# EAGLE schematic Main board schematics (EAGLE 9.6.2)

## Sheet 1 of 3
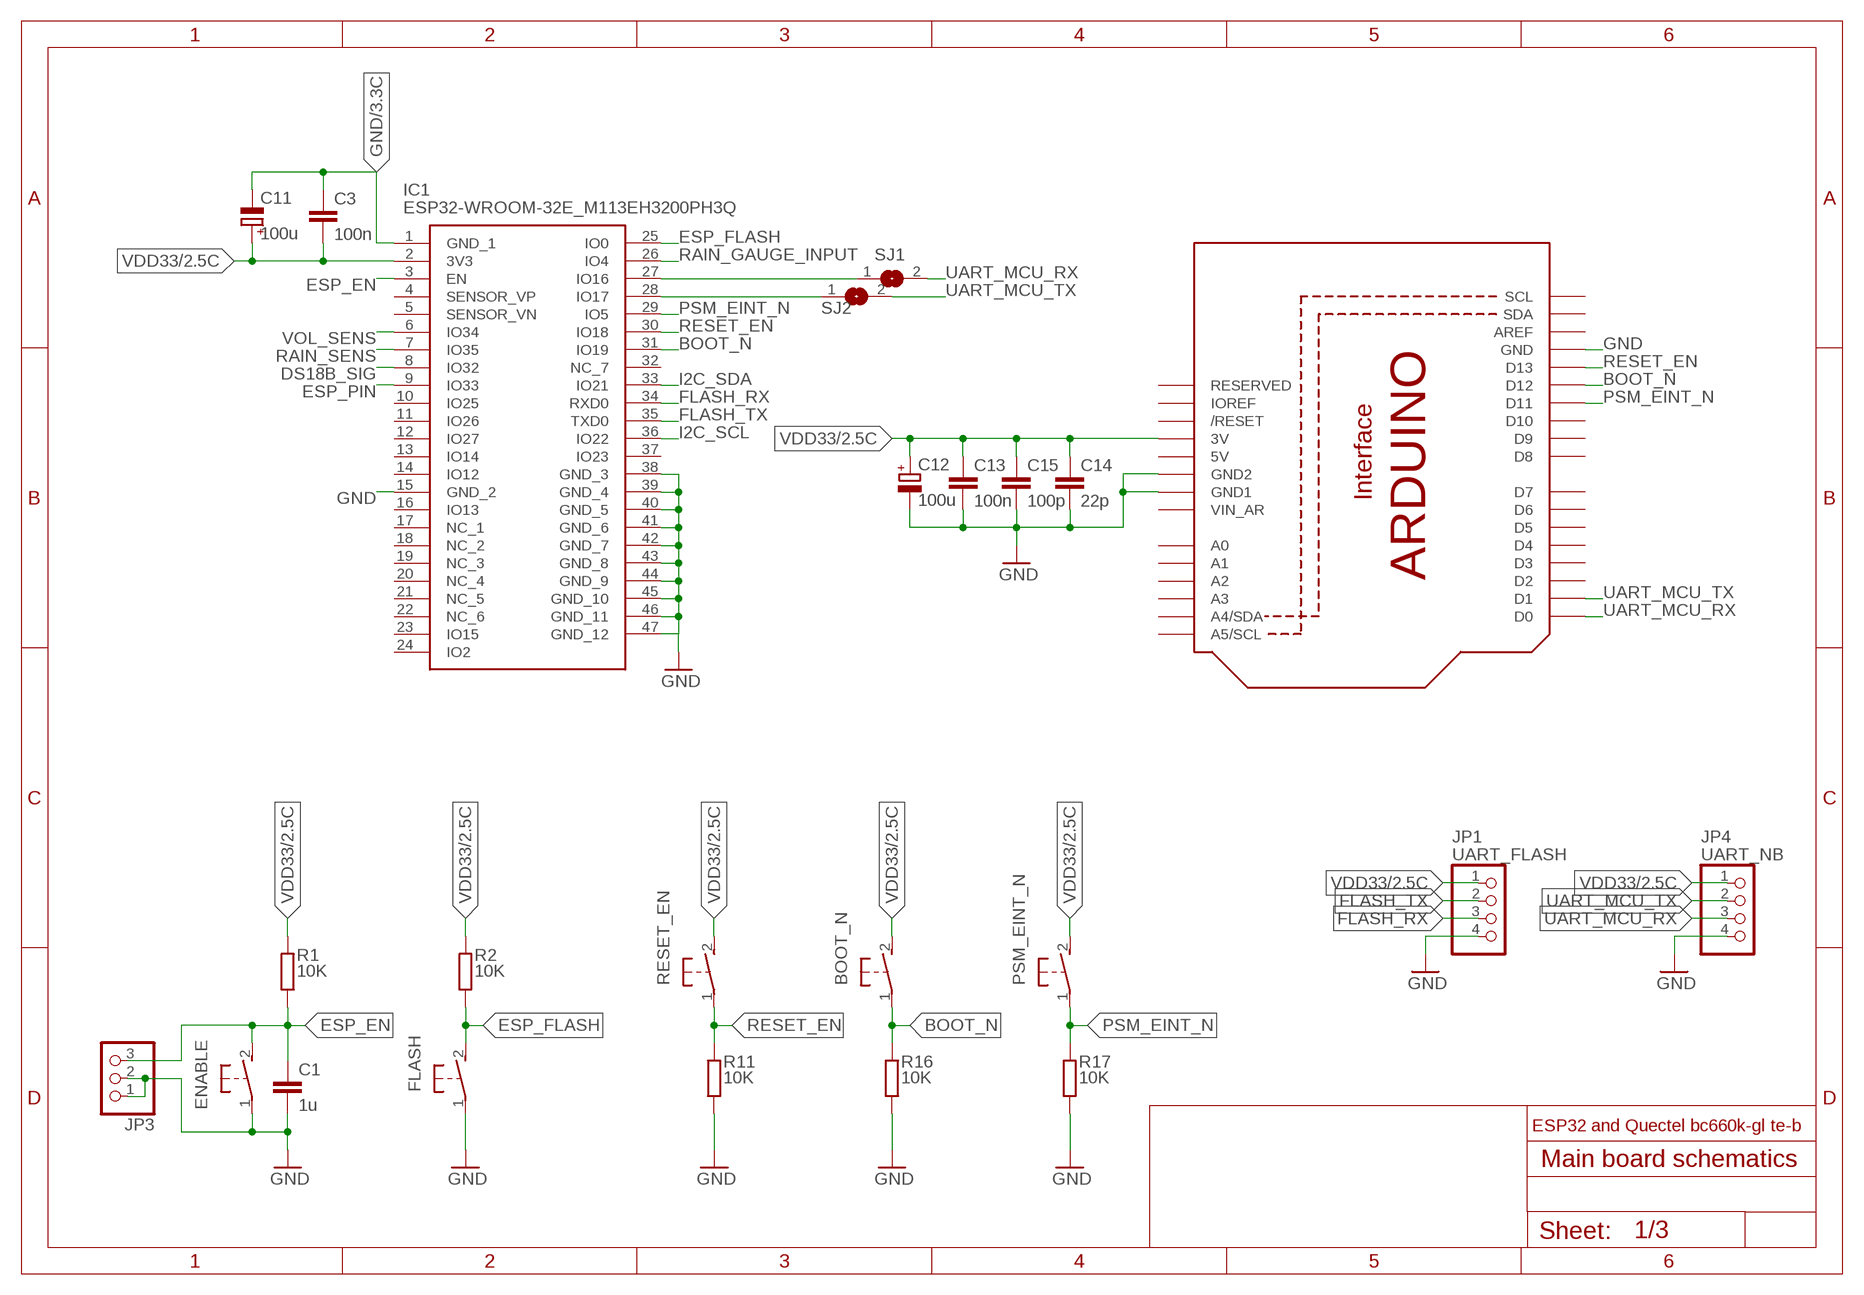
[diagram p0: schematic, sheet 1]

### Parts
BOOT_N  31-XX  [B3F-31XX]
C1  1u  C-EUC0805  [C0805]
C3  100n  C-EUC0805  [C0805]
C11  100u  CPOL-EUD  [PANASONIC_D]
C12  100u  CPOL-EUD  [PANASONIC_D]
C13  100n  C-EUC0805  [C0805]
C14  22p  C-EUC0805  [C0805]
C15  100p  C-EUC0805  [C0805]
ENABLE  31-XX  [B3F-31XX]
FLASH  31-XX  [B3F-31XX]
IC1  ESP32-WROOM-32E_M113EH3200PH3Q  [ESP32WROOM32EM113EH3200PH3Q0]
JP1  UART_FLASH  PINHD-1X4  [1X04]
JP3  PINHD-1X3  [1X03]
JP4  UART_NB  PINHD-1X4  [1X04]
PSM_EINT_N  31-XX  [B3F-31XX]
R1  10K  R-EU_R0805  [R0805]
R2  10K  R-EU_R0805  [R0805]
R11  10K  R-EU_R0805  [R0805]
R16  10K  R-EU_R0805  [R0805]
R17  10K  R-EU_R0805  [R0805]
RESET_EN  31-XX  [B3F-31XX]
SJ1  SJ  [SJ]
SJ2  SJ  [SJ]
U2  ARDUINOR3-BPLACE  [ARDUINOR3]

### Nets
BOOT_N: BOOT_N.1(P) IC1.31(IO19) R16.2 U2.D12
DS18B_SIG: IC1.8(IO32) ; also sheet 3
ESP_EN: C1.1 ENABLE.2(S) IC1.3(EN) JP3.3 R1.1
ESP_FLASH: FLASH.2(S) IC1.25(IO0) R2.1
ESP_PIN: IC1.9(IO33) ; also sheet 3
FLASH_RX: IC1.34(RXD0) JP1.3
FLASH_TX: IC1.35(TXD0) JP1.2
GND: C1.2 C3.1 C11.- C12.- C13.2 C14.2 C15.2 ENABLE.1(P) FLASH.1(P) IC1.1(GND_1) IC1.15(GND_2) IC1.38(GND_3) IC1.39(GND_4) IC1.40(GND_5) IC1.41(GND_6) IC1.42(GND_7) IC1.43(GND_8) IC1.44(GND_9) IC1.45(GND_10) IC1.46(GND_11) IC1.47(GND_12) JP1.4 JP3.1 JP3.2 JP4.4 R11.1 R16.1 R17.1 U2.D14(GND) U2.GND U2.GND1 U2.GND2 ; also sheet 2,3
I2C_SCL: IC1.36(IO22) ; also sheet 3
I2C_SDA: IC1.33(IO21) ; also sheet 3
N$1: IC1.27(IO16) SJ1.1
N$2: IC1.28(IO17) SJ2.1
PSM_EINT_N: IC1.29(IO5) PSM_EINT_N.1(P) R17.2 U2.D11
RAIN_GAUGE_INPUT: IC1.26(IO4) ; also sheet 3
RAIN_SENS: IC1.7(IO35)
RESET_EN: IC1.30(IO18) R11.2 RESET_EN.1(P) U2.D13
UART_MCU_RX: JP4.3 SJ1.2 U2.D0
UART_MCU_TX: JP4.2 SJ2.2 U2.D1
VDD33: BOOT_N.2(S) C3.2 C11.+ C12.+ C13.1 C14.1 C15.1 IC1.2(3V3) JP1.1 JP4.1 PSM_EINT_N.2(S) R1.2 R2.2 RESET_EN.2(S) U2.VBAT(3V) ; also sheet 2,3
VOL_SENS: IC1.6(IO34) ; also sheet 3
Unconnected: IC1.4(SENSOR_VP) IC1.5(SENSOR_VN) IC1.10(IO25) IC1.11(IO26) IC1.12(IO27) IC1.13(IO14) IC1.14(IO12) IC1.16(IO13) IC1.17(NC_1) IC1.18(NC_2) IC1.19(NC_3) IC1.20(NC_4) IC1.21(NC_5) IC1.22(NC_6) IC1.23(IO15) IC1.24(IO2) IC1.32(NC_7) IC1.37(IO23) U2.A0 U2.A1 U2.A2 U2.A3 U2.A4(A4/SDA) U2.A5(A5/SCL) U2.AREF U2.D2 U2.D3 U2.D4 U2.D5 U2.D6 U2.D7 U2.D8 U2.D9 U2.D10 U2.IOREF U2.RESERVED U2.RESET(/RESET) U2.SCL U2.SDA

### Notes on the sheet
- ESP32 and Quectel bc660k-gl te-b

## Sheet 2 of 3
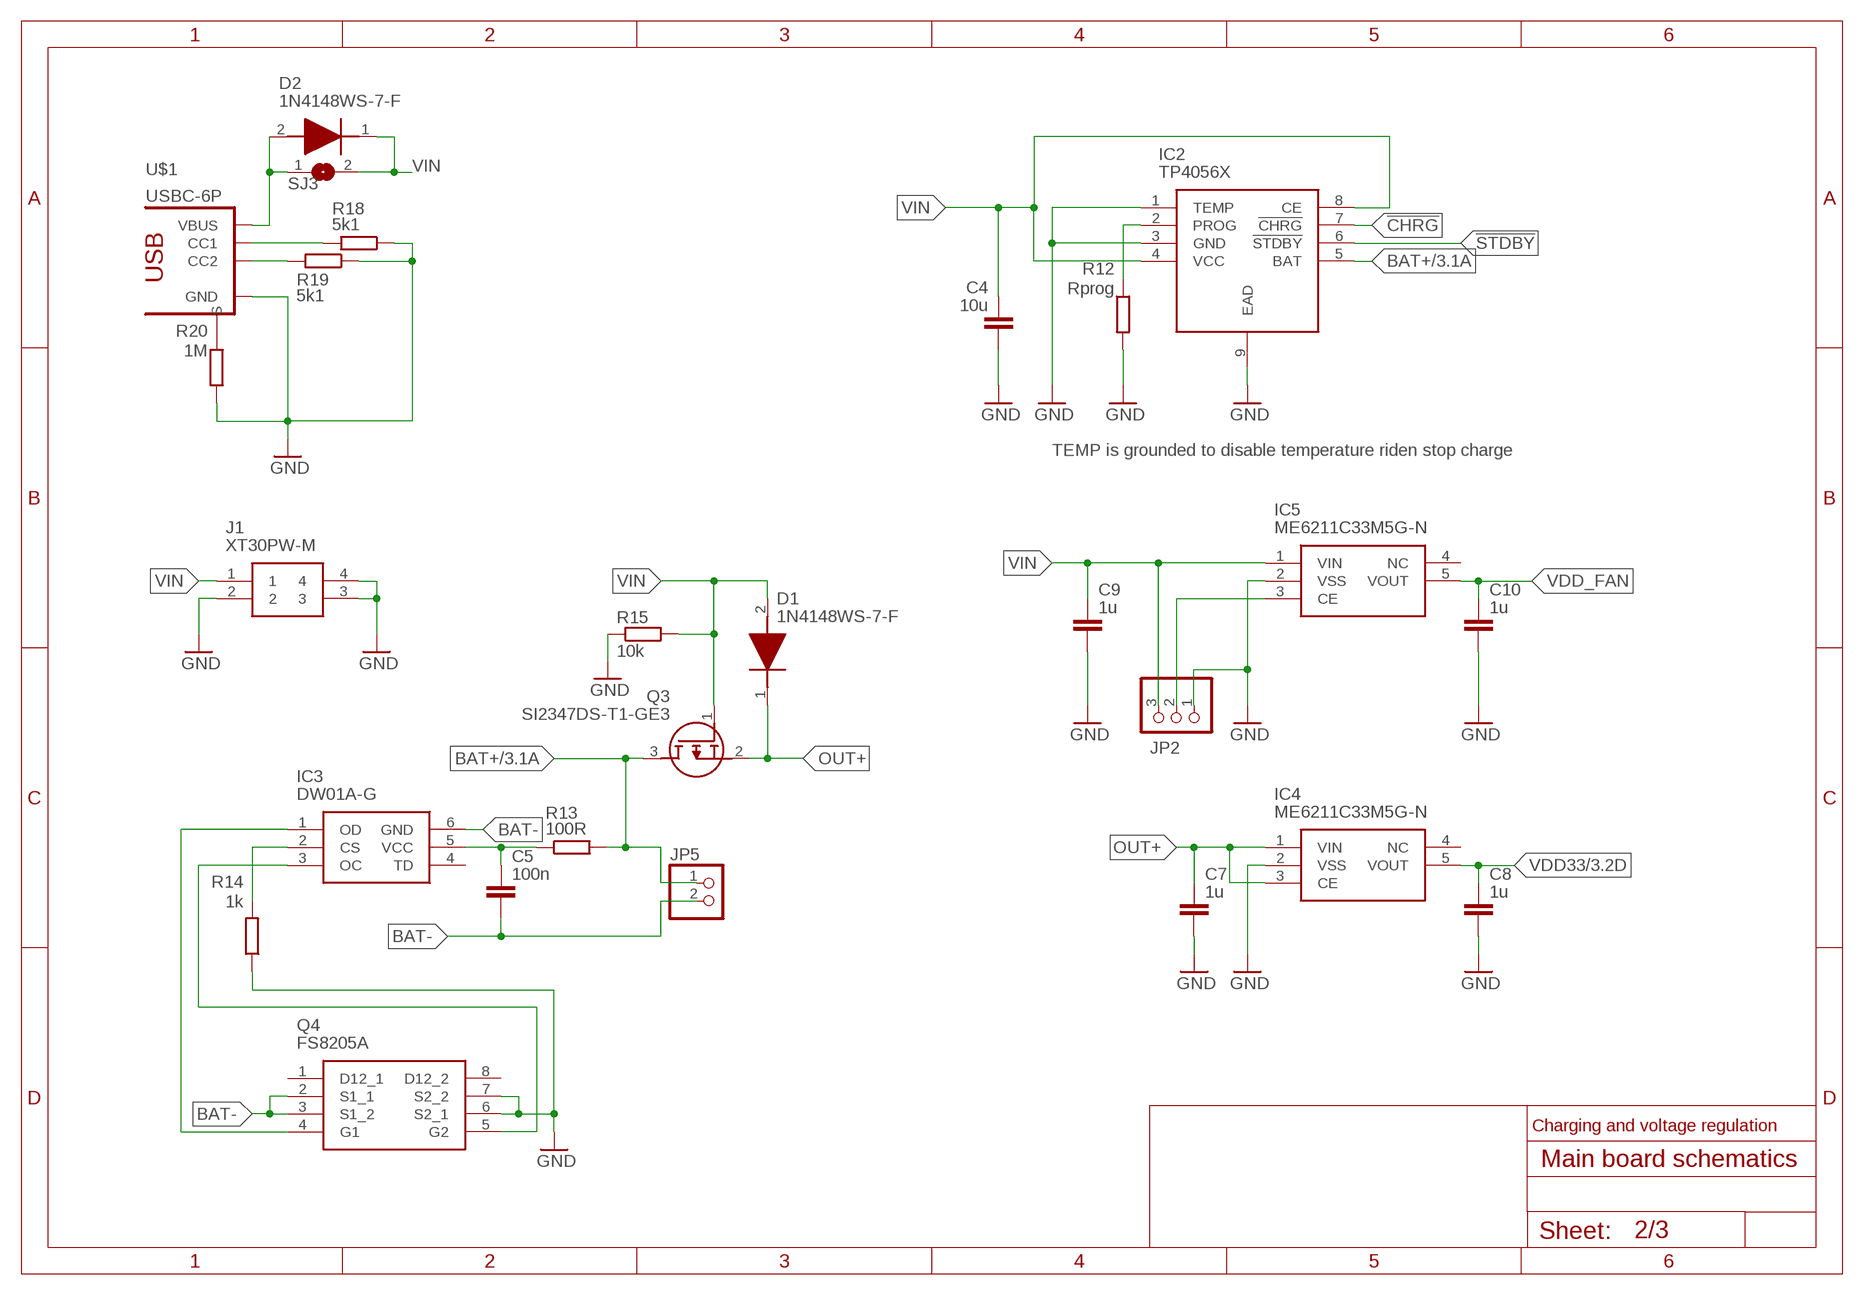
[diagram p1: schematic, sheet 2]

### Parts
C4  10u  C-EUC0805  [C0805]
C5  100n  C-EUC0805  [C0805]
C7  1u  C-EUC0805  [C0805]
C8  1u  C-EUC0805  [C0805]
C9  1u  C-EUC0805  [C0805]
C10  1u  C-EUC0805  [C0805]
D1  1N4148WS-7-F  [SOD2513X120N]
D2  1N4148WS-7-F  [SOD2513X120N]
IC2  TP4056X  [SOIC127P600X175-9N]
IC3  DW01A-G  [SOT95P280X135-6N]
IC4  ME6211C33M5G-N  [SOT95P270X145-5N]
IC5  ME6211C33M5G-N  [SOT95P270X145-5N]
J1  XT30PW-M  [XT30PWM]
JP2  PINHD-1X3  [1X03]
JP5  PINHD-1X2  [1X02]
Q3  SI2347DS-T1-GE3  [SOT95P237X112-3N]
Q4  FS8205A  [SOP65P640X120-8N]
R12  Rprog  R-EU_R0805  [R0805]
R13  100R  R-EU_R0805  [R0805]
R14  1k  R-EU_R0805  [R0805]
R15  10k  R-EU_R0805  [R0805]
R18  5k1  R-EU_R0805  [R0805]
R19  5k1  R-EU_R0805  [R0805]
R20  1M  R-EU_R0805  [R0805]
SJ3  SJ  [SJ]
U$1  USBC-6P  [USCX-06FX-XXMX-01]

### Nets
!CHRG: IC2.7(!CHRG)
!STDBY: IC2.6(!STDBY)
BAT+: IC2.5(BAT) JP5.1 Q3.3(D) R13.2 ; also sheet 3
BAT-: C5.2 IC3.6(GND) JP5.2 Q4.2(S1_1) Q4.3(S1_2)
GND: C4.2 C7.2 C8.2 C9.2 C10.2 IC2.1(TEMP) IC2.3(GND) IC2.9(EAD) IC4.2(VSS) IC5.2(VSS) J1.2 J1.3 J1.4 JP2.1 Q4.6(S2_1) Q4.7(S2_2) R12.2 R14.1 R15.1 R18.1 R19.1 R20.2 U$1.GND1(GND) U$1.GND2(GND) ; also sheet 1,3
N$4: IC2.2(PROG) R12.1
N$5: D2.2(A) SJ3.1 U$1.VBUS1(VBUS) U$1.VBUS2(VBUS)
N$6: IC5.3(CE) JP2.2
N$7: C5.1 IC3.5(VCC) R13.1
N$8: R20.1 U$1.SHIELD1(S) U$1.SHIELD2(S) U$1.SHIELD3(S) U$1.SHIELD4(S)
N$9: IC3.2(CS) R14.2
N$10: IC3.1(OD) Q4.4(G1)
N$11: R19.2 U$1.CC2
N$12: IC3.3(OC) Q4.5(G2)
N$13: R18.2 U$1.CC1
OUT+: C7.1 D1.1(K) IC4.1(VIN) IC4.3(CE) Q3.2(S)
VDD33: C8.1 IC4.5(VOUT) ; also sheet 1,3
VDD_FAN: C10.1 IC5.5(VOUT) ; also sheet 3
VIN: C4.1 C9.1 D1.2(A) D2.1(K) IC2.4(VCC) IC2.8(CE) IC5.1(VIN) J1.1 JP2.3 Q3.1(G) R15.2 SJ3.2
Unconnected: IC3.4(TD) IC4.4(NC) IC5.4(NC) Q4.1(D12_1) Q4.8(D12_2)

### Notes on the sheet
- TEMP is grounded to disable temperature riden stop charge
- Charging and voltage regulation

## Sheet 3 of 3
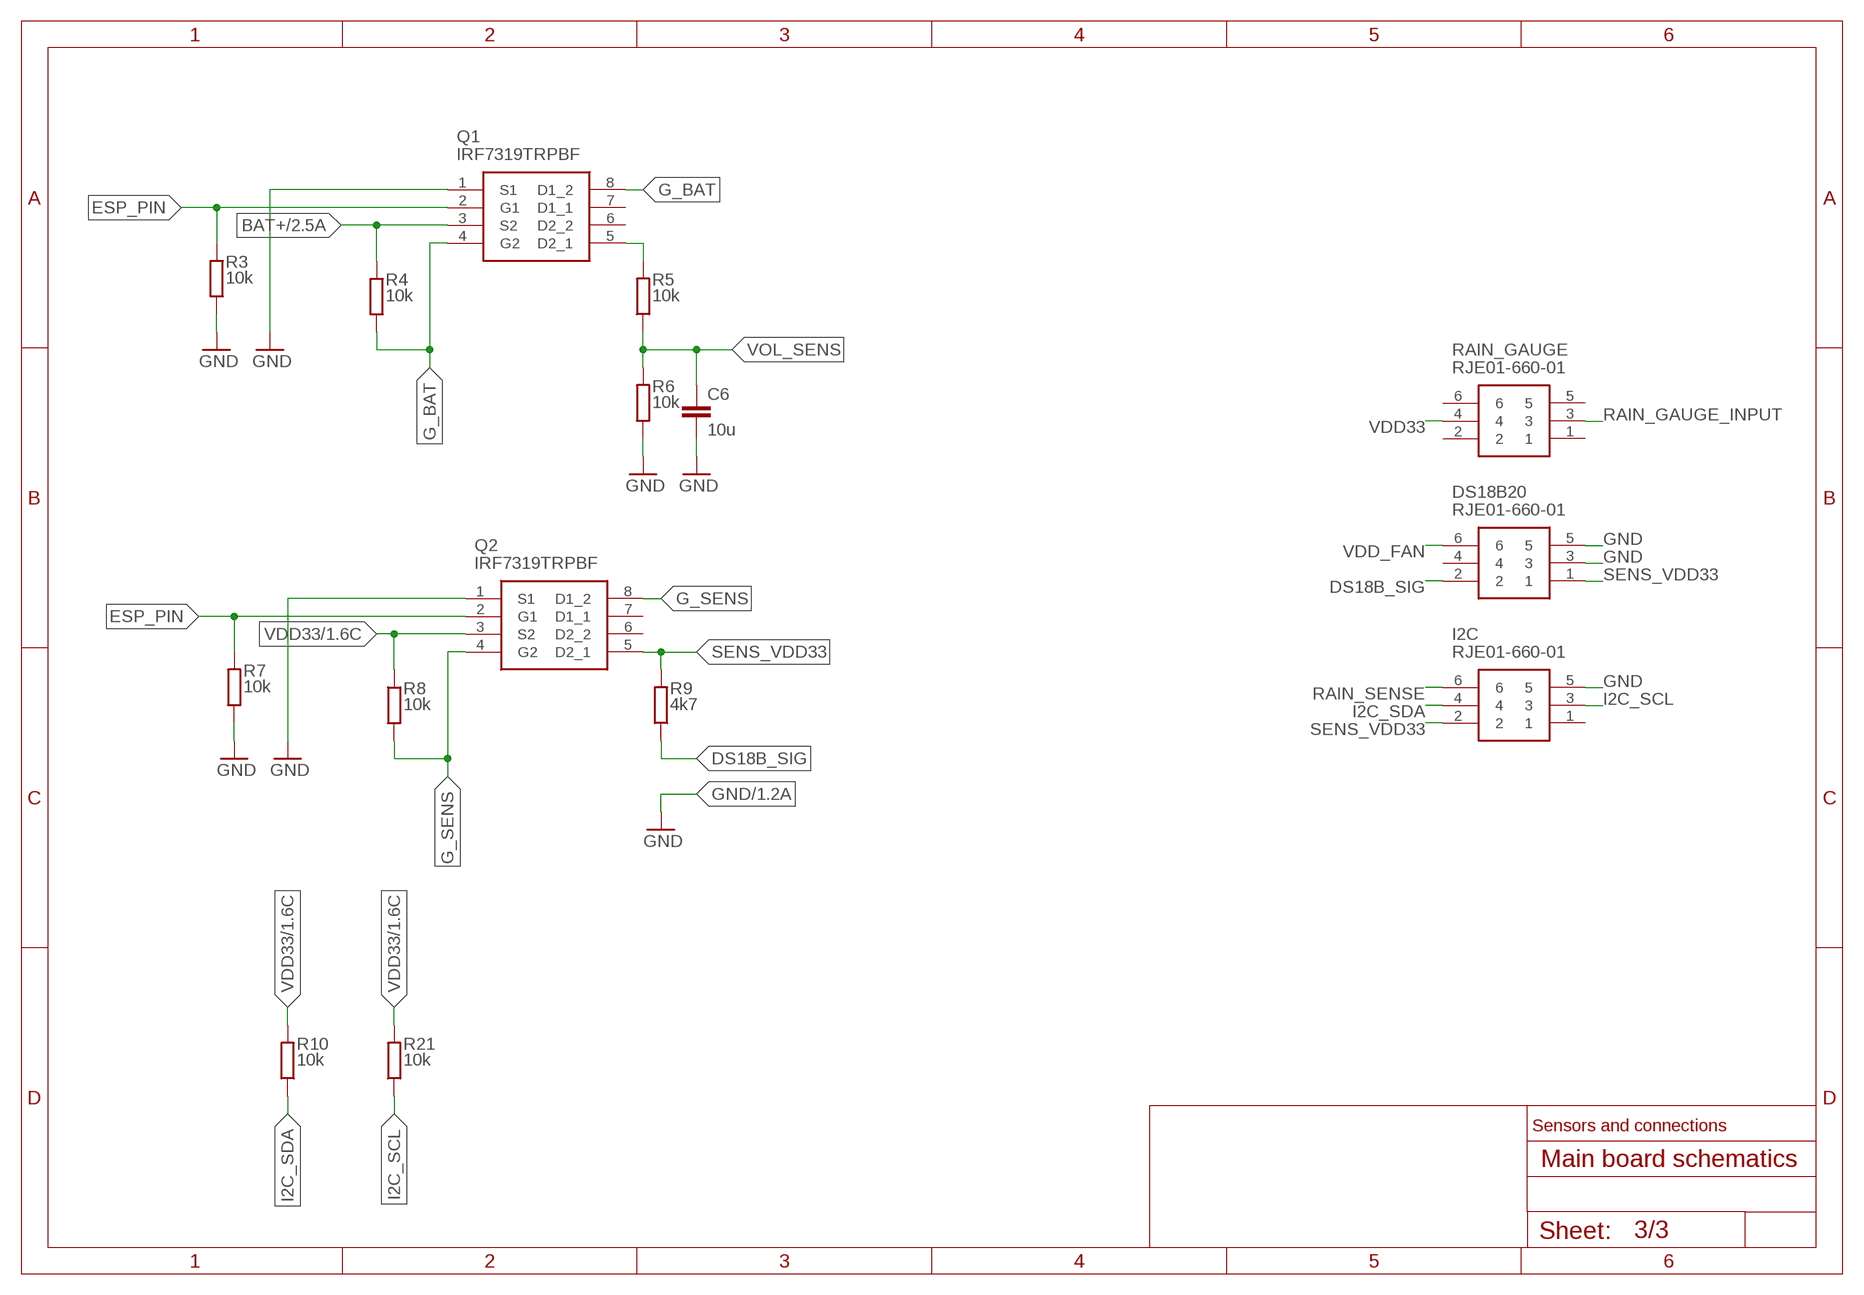
[diagram p2: schematic, sheet 3]

### Parts
C6  10u  C-EUC1206  [C1206]
DS18B20  RJE01-660-01  [RJE0166001]
I2C  RJE01-660-01  [RJE0166001]
Q1  IRF7319TRPBF  [SOIC127P600X175-8N]
Q2  IRF7319TRPBF  [SOIC127P600X175-8N]
R3  10k  R-EU_R0805  [R0805]
R4  10k  R-EU_R0805  [R0805]
R5  10k  R-EU_R0805  [R0805]
R6  10k  R-EU_R0805  [R0805]
R7  10k  R-EU_R0805  [R0805]
R8  10k  R-EU_R0805  [R0805]
R9  4k7  R-EU_R0805  [R0805]
R10  10k  R-EU_R0805  [R0805]
R21  10k  R-EU_R0805  [R0805]
RAIN_GAUGE  RJE01-660-01  [RJE0166001]

### Nets
BAT+: Q1.3(S2) R4.1 ; also sheet 2
DS18B_SIG: DS18B20.2 R9.1 ; also sheet 1
ESP_PIN: Q1.2(G1) Q2.2(G1) R3.2 R7.2 ; also sheet 1
G_BAT: Q1.4(G2) Q1.8(D1_2) R4.2
G_SENS: Q2.4(G2) Q2.8(D1_2) R8.2
GND: C6.2 DS18B20.3 DS18B20.5 I2C.5 Q1.1(S1) Q2.1(S1) R3.1 R6.1 R7.1 ; also sheet 1,2
I2C_SCL: I2C.3 R21.1 ; also sheet 1
I2C_SDA: I2C.4 R10.1 ; also sheet 1
N$3: Q1.5(D2_1) R5.2
RAIN_GAUGE_INPUT: RAIN_GAUGE.3 ; also sheet 1
RAIN_SENSE: I2C.6
SENS_VDD33: DS18B20.1 I2C.2 Q2.5(D2_1) R9.2
VDD33: Q2.3(S2) R8.1 R10.2 R21.2 RAIN_GAUGE.4 ; also sheet 1,2
VDD_FAN: DS18B20.6 ; also sheet 2
VOL_SENS: C6.1 R5.1 R6.2 ; also sheet 1
Unconnected: DS18B20.4 I2C.1 Q1.6(D2_2) Q1.7(D1_1) Q2.6(D2_2) Q2.7(D1_1) RAIN_GAUGE.1 RAIN_GAUGE.2 RAIN_GAUGE.5 RAIN_GAUGE.6

### Notes on the sheet
- Sensors and connections

## Power pins joined to a net without a drawn wire
5V: U2.5V
VIN_AR: U2.VIN_AR

## Library data of the parts
BOOT_N ENABLE FLASH PSM_EINT_N RESET_EN = switch-omron:31-XX: OMRON SWITCH; MPN: B3F-3100; OC_FARNELL: 959704; OC_NEWARK: 36M3582
C1 C3-C10 C13-C15 = rcl:C-EU: CAPACITOR, European symbol; SPICEPREFIX: C
C11 C12 = rcl:CPOL-EU: POLARIZED CAPACITOR, European symbol; SPICEPREFIX: C
D1 D2 = 1-component-search:1N4148WS-7-F: Diode Switching 150mA 75V 200mW SOD323 Diodes Inc 1N4148WS-7-F Switching Diode, 150mA 75V, 2-Pin SOD-323 Source: Datasheet <https://componentsearchengine.com/Datasheets/2/1N4148WS-7-F.pdf>; ARROW_PART_NUMBER: 1N4148WS-7-F; ARROW_PRICE-STOCK: https://www.arrow.com/en/products/1n4148ws-7-f/diodes-incorporated?region=nac; DESCRIPTION: Diode Switching 150mA 75V 200mW SOD323 Diodes Inc 1N4148WS-7-F Switching Diode, 150mA 75V, 2-Pin SOD-323; HEIGHT: 1.2mm; MANUFACTURER_NAME: Diodes Inc.; MANUFACTURER_PART_NUMBER: 1N4148WS-7-F; MOUSER_PART_NUMBER: 621-1N4148WS-F; MOUSER_PRICE-STOCK: https://www.mouser.co.uk/ProductDetail/Diodes-Incorporated/1N4148WS-7-F?qs=4drIV0IxA0r8aNy7%2Fu4kVw%3D%3D
DS18B20 I2C RAIN_GAUGE = 1-component-search:RJE01-660-01: Modular Connectors / Ethernet Connectors Mod Jack Cat3 RJ11 Gold Source: Datasheet <https://www.mouser.com/datasheet/2/18/amphenol_RJE016X001-1157271.pdf>; ARROW_PART_NUMBER: RJE01-660-01; ARROW_PRICE-STOCK: https://www.arrow.com/en/products/rje01-660-01/amphenol-fci?region=nac; DESCRIPTION: Modular Connectors / Ethernet Connectors Mod Jack Cat3 RJ11 Gold; HEIGHT: 12.88mm; MANUFACTURER_NAME: Amphenol; MANUFACTURER_PART_NUMBER: RJE01-660-01; MOUSER_PART_NUMBER: 523-RJE01-660-01; MOUSER_PRICE-STOCK: https://www.mouser.co.uk/ProductDetail/Amphenol-Commercial-Products/RJE01-660-01?qs=St27ATL478szj4V93DJo9w%3D%3D
IC1 = 1-component-search:ESP32-WROOM-32E_M113EH3200PH3Q: WiFi Modules (802.11) SMD Module ESP32-D0WD-V3, 4 MB SPI flash, PCB antenna Source: Datasheet <https://www.mouser.com/datasheet/2/891/esp32-wroom-32e_esp32-wroom-32ue_datasheet_en-1855879.pdf>; DESCRIPTION: WiFi Modules (802.11) SMD Module ESP32-D0WD-V3, 4 MB SPI flash, PCB antenna; HEIGHT: 3.25mm; MANUFACTURER_NAME: Espressif Systems; MANUFACTURER_PART_NUMBER: ESP32-WROOM-32E(M113EH3200PH3Q0); MOUSER_PART_NUMBER: 356-ESP32WRM32E132PH; MOUSER_PRICE-STOCK: https://www.mouser.co.uk/ProductDetail/Espressif-Systems/ESP32-WROOM-32EM113EH3200PH3Q0?qs=vHuUswq2%252Bsx8Xcp7bzmaHA%3D%3D
IC2 = TP4056X:TP4056X: PMIC - Battery Management SOP-8_EP_150mil RoHS Source: Datasheet <https://datasheet.lcsc.com/szlcsc/Nanjing-Extension-Microelectronics-TP4056X_C191323.pdf>; DESCRIPTION: PMIC - Battery Management SOP-8_EP_150mil RoHS; HEIGHT: 1.75mm; MANUFACTURER_NAME: Nanjing Extension Microelectronics; MANUFACTURER_PART_NUMBER: TP4056X
IC3 = 1-component-search:DW01A-G: One Cell Lithium-ion/Polymer Battery Protection IC Source: Datasheet <http://acoptex.com/uploads/DW01A.pdf>; DESCRIPTION: One Cell Lithium-ion/Polymer Battery Protection IC; HEIGHT: 1.35mm; MANUFACTURER_NAME: Fortune Semiconductor Corporation; MANUFACTURER_PART_NUMBER: DW01A-G
IC4 IC5 = 1-component-search:ME6211C33M5G-N: Fixed 6V 3.3V 500mA SOT-23-5 Low Dropout Regulators(LDO) RoHS Source: Datasheet <https://datasheet.lcsc.com/szlcsc/1811131510_MICRONE-Nanjing-Micro-One-Elec-ME6211C33M5G-N_C82942.pdf>; DESCRIPTION: Fixed 6V 3.3V 500mA SOT-23-5 Low Dropout Regulators(LDO) RoHS; HEIGHT: 1.45mm; MANUFACTURER_NAME: Microne; MANUFACTURER_PART_NUMBER: ME6211C33M5G-N
J1 = 1-component-search:XT30PW-M: 30A Low Temperature Rise Fire Retardant Plug Source: Datasheet <https://www.tme.eu/sl/Document/ce4077e36b79046da520ca73227e15de/XT30PW SPEC.pdf>; DESCRIPTION: 30A Low Temperature Rise Fire Retardant Plug; HEIGHT: 5mm; MANUFACTURER_NAME: Amass; MANUFACTURER_PART_NUMBER: XT30PW-M
JP1 JP4 = pinhead:PINHD-1X4: PIN HEADER
JP2 JP3 = pinhead:PINHD-1X3: PIN HEADER
JP5 = pinhead:PINHD-1X2: PIN HEADER
Q1 Q2 = 1-component-search:IRF7319TRPBF: IRF7319TRPBF Dual N/P-Channel MOSFET, 4.9 A, 6.5 A, 30 V HEXFET, 8-Pin SOIC Infineon Source: Datasheet <https://www.infineon.com/dgdl/irf7319pbf.pdf?fileId=5546d462533600a4015355f5c82f1b41>; ARROW_PART_NUMBER: IRF7319TRPBF; ARROW_PRICE-STOCK: https://www.arrow.com/en/products/irf7319trpbf/infineon-technologies-ag?region=nac; DESCRIPTION: IRF7319TRPBF Dual N/P-Channel MOSFET, 4.9 A, 6.5 A, 30 V HEXFET, 8-Pin SOIC Infineon; HEIGHT: 1.75mm; MANUFACTURER_NAME: Infineon; MANUFACTURER_PART_NUMBER: IRF7319TRPBF; MOUSER_PART_NUMBER: 942-IRF7319TRPBF; MOUSER_PRICE-STOCK: https://www.mouser.co.uk/ProductDetail/Infineon-IR/IRF7319TRPBF?qs=9%252BKlkBgLFf3yLUxG6ZIMRA%3D%3D
Q3 = 1-component-search:SI2347DS-T1-GE3: P-Ch MOSFET SOT-23 copper 30V 42mohm @ 1 Source: Datasheet <https://www.vishay.com/docs/62827/si2347ds.pdf>; ARROW_PART_NUMBER: SI2347DS-T1-GE3; ARROW_PRICE-STOCK: https://www.arrow.com/en/products/si2347ds-t1-ge3/vishay?region=nac; DESCRIPTION: P-Ch MOSFET SOT-23 copper 30V 42mohm @ 1; HEIGHT: 1.12mm; MANUFACTURER_NAME: Vishay; MANUFACTURER_PART_NUMBER: Si2347DS-T1-GE3; MOUSER_PART_NUMBER: 78-SI2347DS-T1-GE3; MOUSER_PRICE-STOCK: https://www.mouser.co.uk/ProductDetail/Vishay-Semiconductors/SI2347DS-T1-GE3?qs=wnm%2FPMJNddFQv4lfacOrcA%3D%3D
Q4 = 1-component-search:FS8205A: Dual N-Channel Enahncement Mode Power MOSFET Source: Datasheet <http://www.ic-fortune.com/upload/Download/FS8205A-DS-12_EN.pdf>; DESCRIPTION: Dual N-Channel Enahncement Mode Power MOSFET; HEIGHT: 1.2mm; MANUFACTURER_NAME: fortune; MANUFACTURER_PART_NUMBER: FS8205A
R1-R21 = rcl:R-EU_: RESISTOR, European symbol; SPICEPREFIX: R
SJ1-SJ3 = jumper:SJ: SMD solder JUMPER
U2 = 1-component-search:ARDUINOR3: Arduin R3 interface
U$1 = USBC6P:USBC-6P: AliExpress Special! Connect 5.1k 10% resistors to each CC pin, pulled up to 3.3v or 5.0v.

## Module A
Ports: 

### Library data of the parts